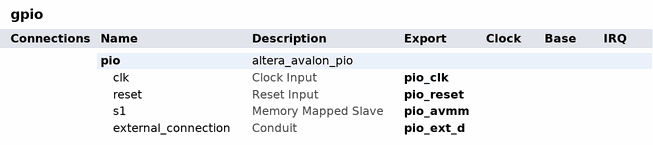
[diagram p0: system contents]
# Platform Designer (Qsys) system gpio, Arria V 5AGTFC7H3F35I3
# Parameters at their usual value, and those the tool derives, are not listed.
package require -exact qsys 21.1
create_system gpio
set_project_property DEVICE_FAMILY {Arria V}
set_project_property DEVICE 5AGTFC7H3F35I3

add_instance pio altera_avalon_pio 21.1
set_instance_parameter_value pio direction Output
set_instance_parameter_value pio width 8

# exported interfaces
add_interface pio_avmm avalon slave
set_interface_property pio_avmm EXPORT_OF pio.s1
add_interface pio_clk clock sink
set_interface_property pio_clk EXPORT_OF pio.clk
add_interface pio_ext_d conduit end
set_interface_property pio_ext_d EXPORT_OF pio.external_connection
add_interface pio_reset reset sink
set_interface_property pio_reset EXPORT_OF pio.reset

set_interconnect_requirement {$system} qsys_mm.clockCrossingAdapter HANDSHAKE
set_interconnect_requirement {$system} qsys_mm.enableEccProtection FALSE
set_interconnect_requirement {$system} qsys_mm.insertDefaultSlave FALSE
set_interconnect_requirement {$system} qsys_mm.maxAdditionalLatency 1

save_system gpio.qsys
